# EAGLE design PCB Fuse Traces (EAGLE 6.3)
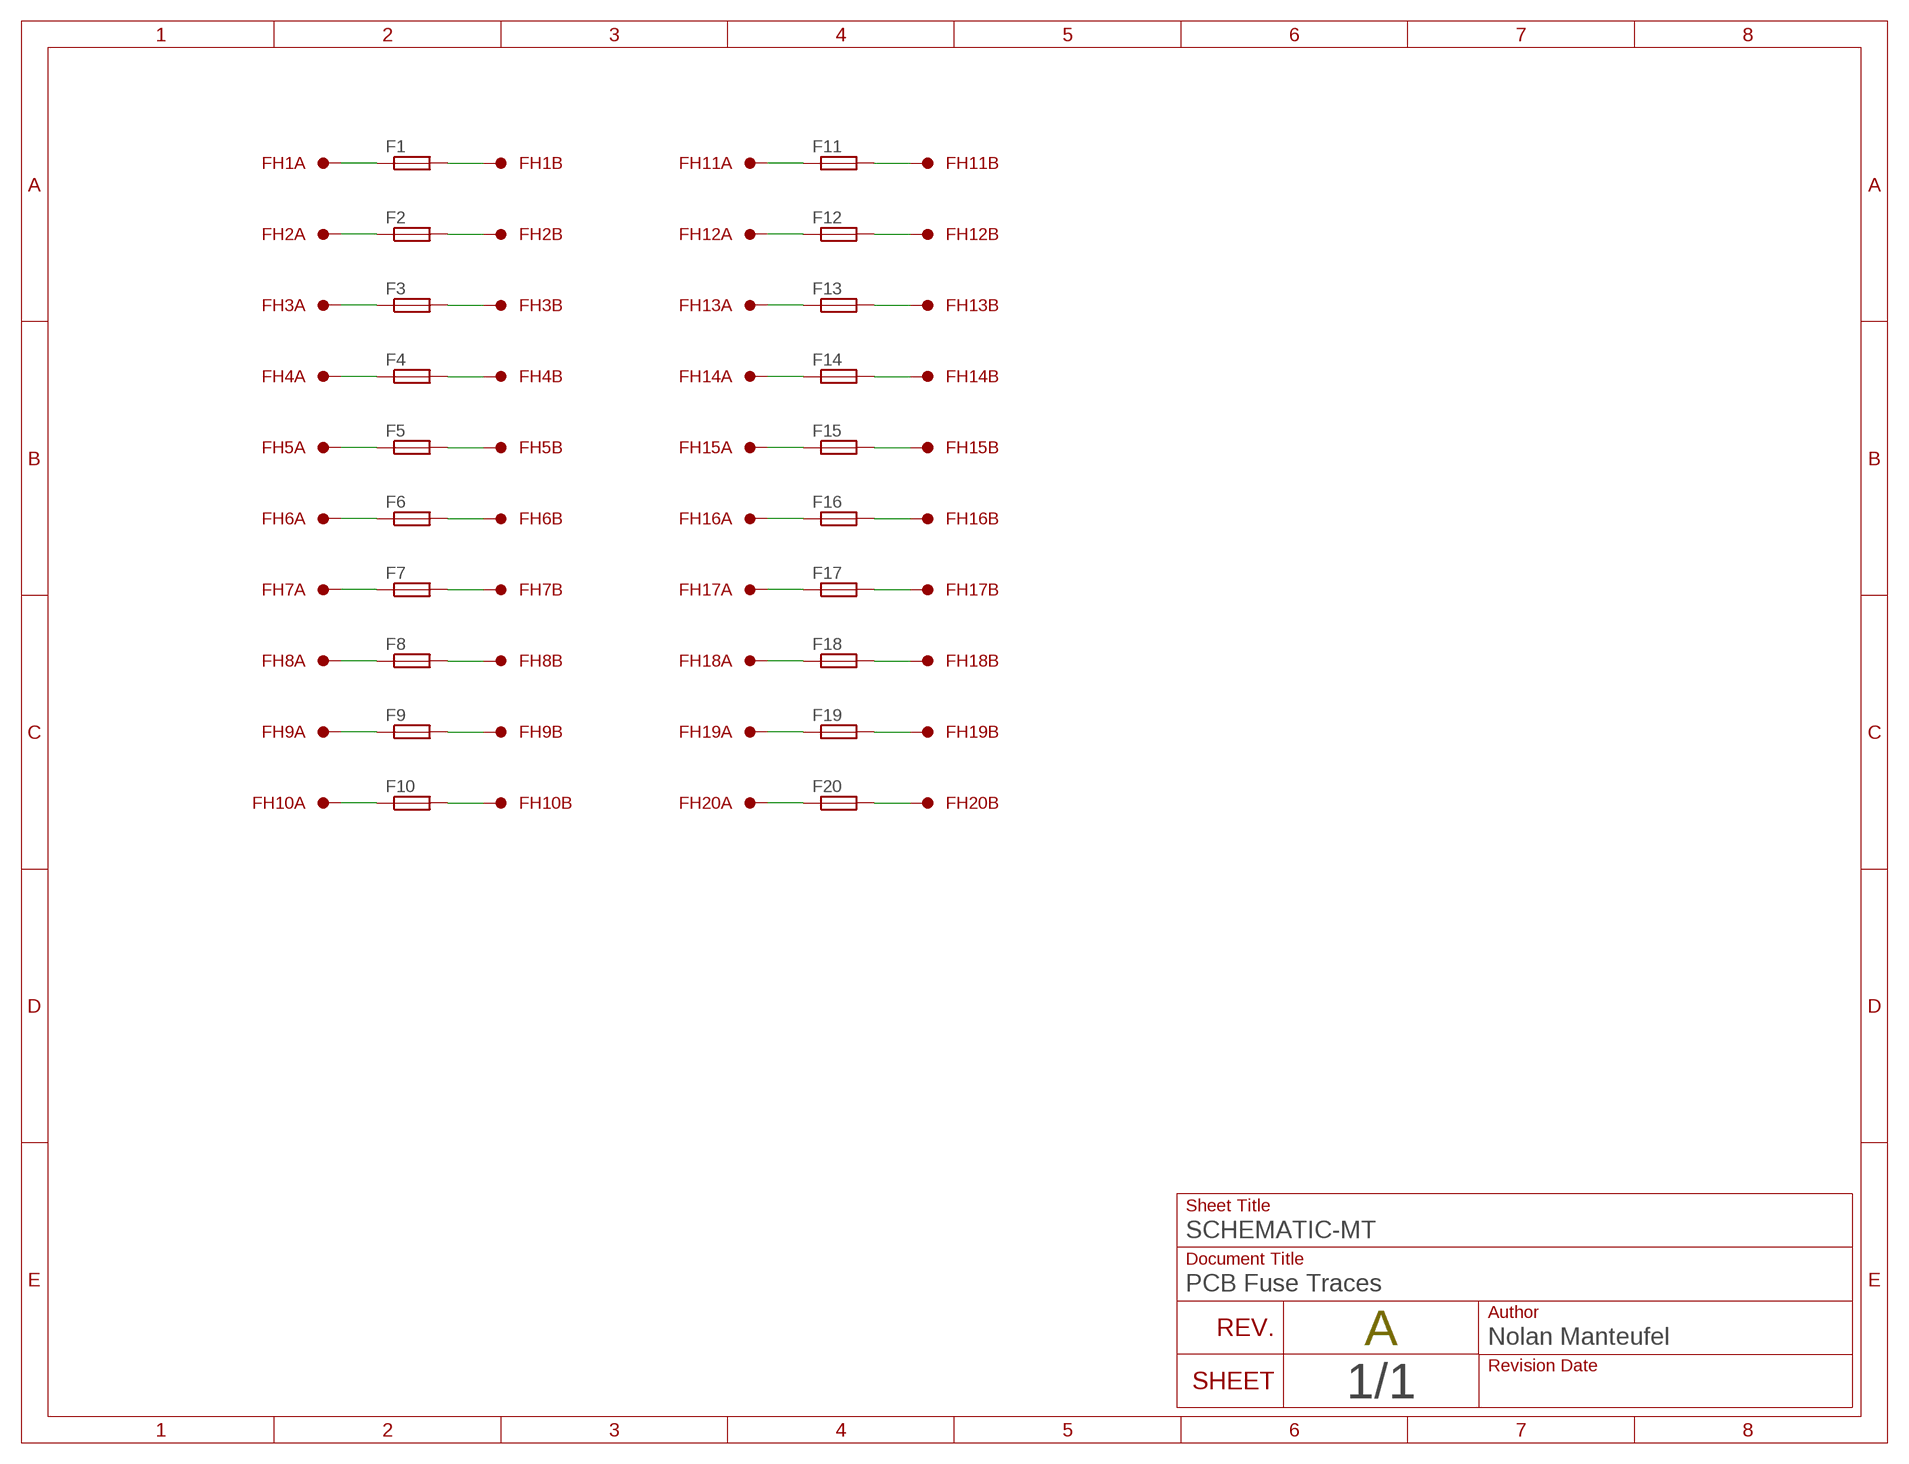
[diagram p0: schematic, sheet 1]

## Parts
F1  FUSEA  [FUSE_A]
F2  FUSEAA  [FUSE_AA]
F3  FUSEAAA  [FUSE_AAA]
F4  FUSEAAAA  [FUSE_AAAA]
F5  FUSEB  [FUSE_B]
F6  FUSEBB  [FUSE_BB]
F7  FUSEC  [FUSE_C]
F8  FUSECC  [FUSE_CC]
F9  FUSED  [FUSE_D]
F10  FUSEDD  [FUSE_DD]
F11  FUSEA0  [FUSE_A0]
F12  FUSEA1  [FUSE_A1]
F13  FUSEA3  [FUSE_A3]
F14  FUSEB1  [FUSE_B1]
F15  FUSEB2  [FUSE_B2]
F16  FUSEB3  [FUSE_B3]
F17  FUSEB4  [FUSE_B4]
F18  FUSE1206  [F1206]
F19  FUSE0805  [F0805]
F20  FUSE0603  [F0603]
FH1  FUSE_HOLDER36MM  [F36_HOLDER]
FH2  FUSE_HOLDER36MM  [F36_HOLDER]
FH3  FUSE_HOLDER36MM  [F36_HOLDER]
FH4  FUSE_HOLDER36MM  [F36_HOLDER]
FH5  FUSE_HOLDER36MM  [F36_HOLDER]
FH6  FUSE_HOLDER36MM  [F36_HOLDER]
FH7  FUSE_HOLDER36MM  [F36_HOLDER]
FH8  FUSE_HOLDER36MM  [F36_HOLDER]
FH9  FUSE_HOLDER36MM  [F36_HOLDER]
FH10  FUSE_HOLDER36MM  [F36_HOLDER]
FH11  FUSE_HOLDER36MM  [F36_HOLDER]
FH12  FUSE_HOLDER36MM  [F36_HOLDER]
FH13  FUSE_HOLDER36MM  [F36_HOLDER]
FH14  FUSE_HOLDER36MM  [F36_HOLDER]
FH15  FUSE_HOLDER36MM  [F36_HOLDER]
FH16  FUSE_HOLDER36MM  [F36_HOLDER]
FH17  FUSE_HOLDER36MM  [F36_HOLDER]
FH18  FUSE_HOLDER36MM  [F36_HOLDER]
FH19  FUSE_HOLDER36MM  [F36_HOLDER]
FH20  FUSE_HOLDER36MM  [F36_HOLDER]

## Nets
N$1: F1.1 FH1.1
N$2: F2.1 FH2.1
N$3: F3.1 FH3.1
N$4: F4.1 FH4.1
N$5: F1.2 FH1.2
N$6: F2.2 FH2.2
N$7: F3.2 FH3.2
N$8: F4.2 FH4.2
N$9: F5.1 FH5.1
N$10: F6.1 FH6.1
N$11: F7.1 FH7.1
N$12: F8.1 FH8.1
N$13: F5.2 FH5.2
N$14: F6.2 FH6.2
N$15: F7.2 FH7.2
N$16: F8.2 FH8.2
N$17: F9.1 FH9.1
N$18: F10.1 FH10.1
N$19: F11.3 FH11.1
N$20: F12.1 FH12.1
N$21: F9.2 FH9.2
N$22: F10.2 FH10.2
N$23: F11.4 FH11.2
N$24: F12.2 FH12.2
N$25: F13.1 FH13.1
N$26: F14.1 FH14.1
N$27: F15.1 FH15.1
N$28: F16.1 FH16.1
N$29: F13.2 FH13.2
N$30: F14.2 FH14.2
N$31: F15.2 FH15.2
N$32: F16.2 FH16.2
N$33: F17.1 FH17.1
N$34: F18.1 FH18.1
N$35: F19.1 FH19.1
N$36: F20.1 FH20.1
N$37: F17.2 FH17.2
N$38: F18.2 FH18.2
N$39: F19.2 FH19.2
N$40: F20.2 FH20.2

## Library data of the parts
F1-F20 = nolan:FUSE
FH1-FH20 = nolan:FUSE_HOLDER

## Board
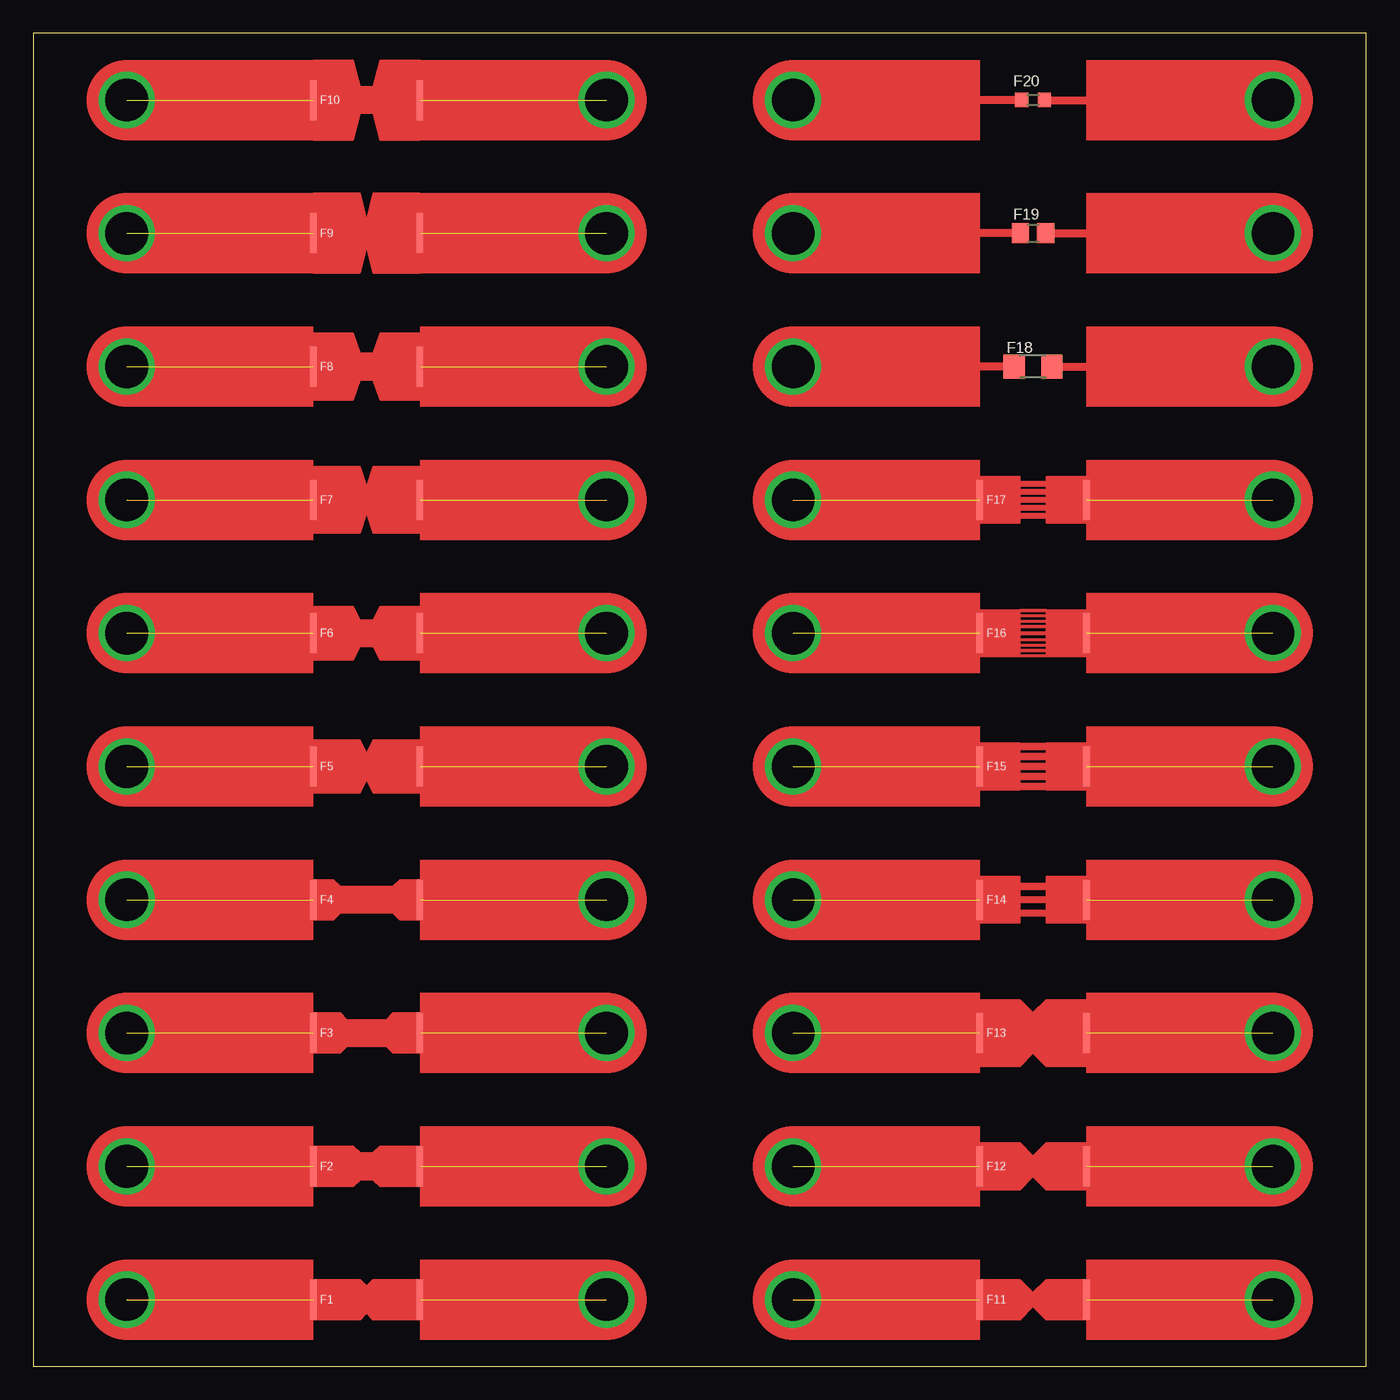
[diagram p1: board, top side]
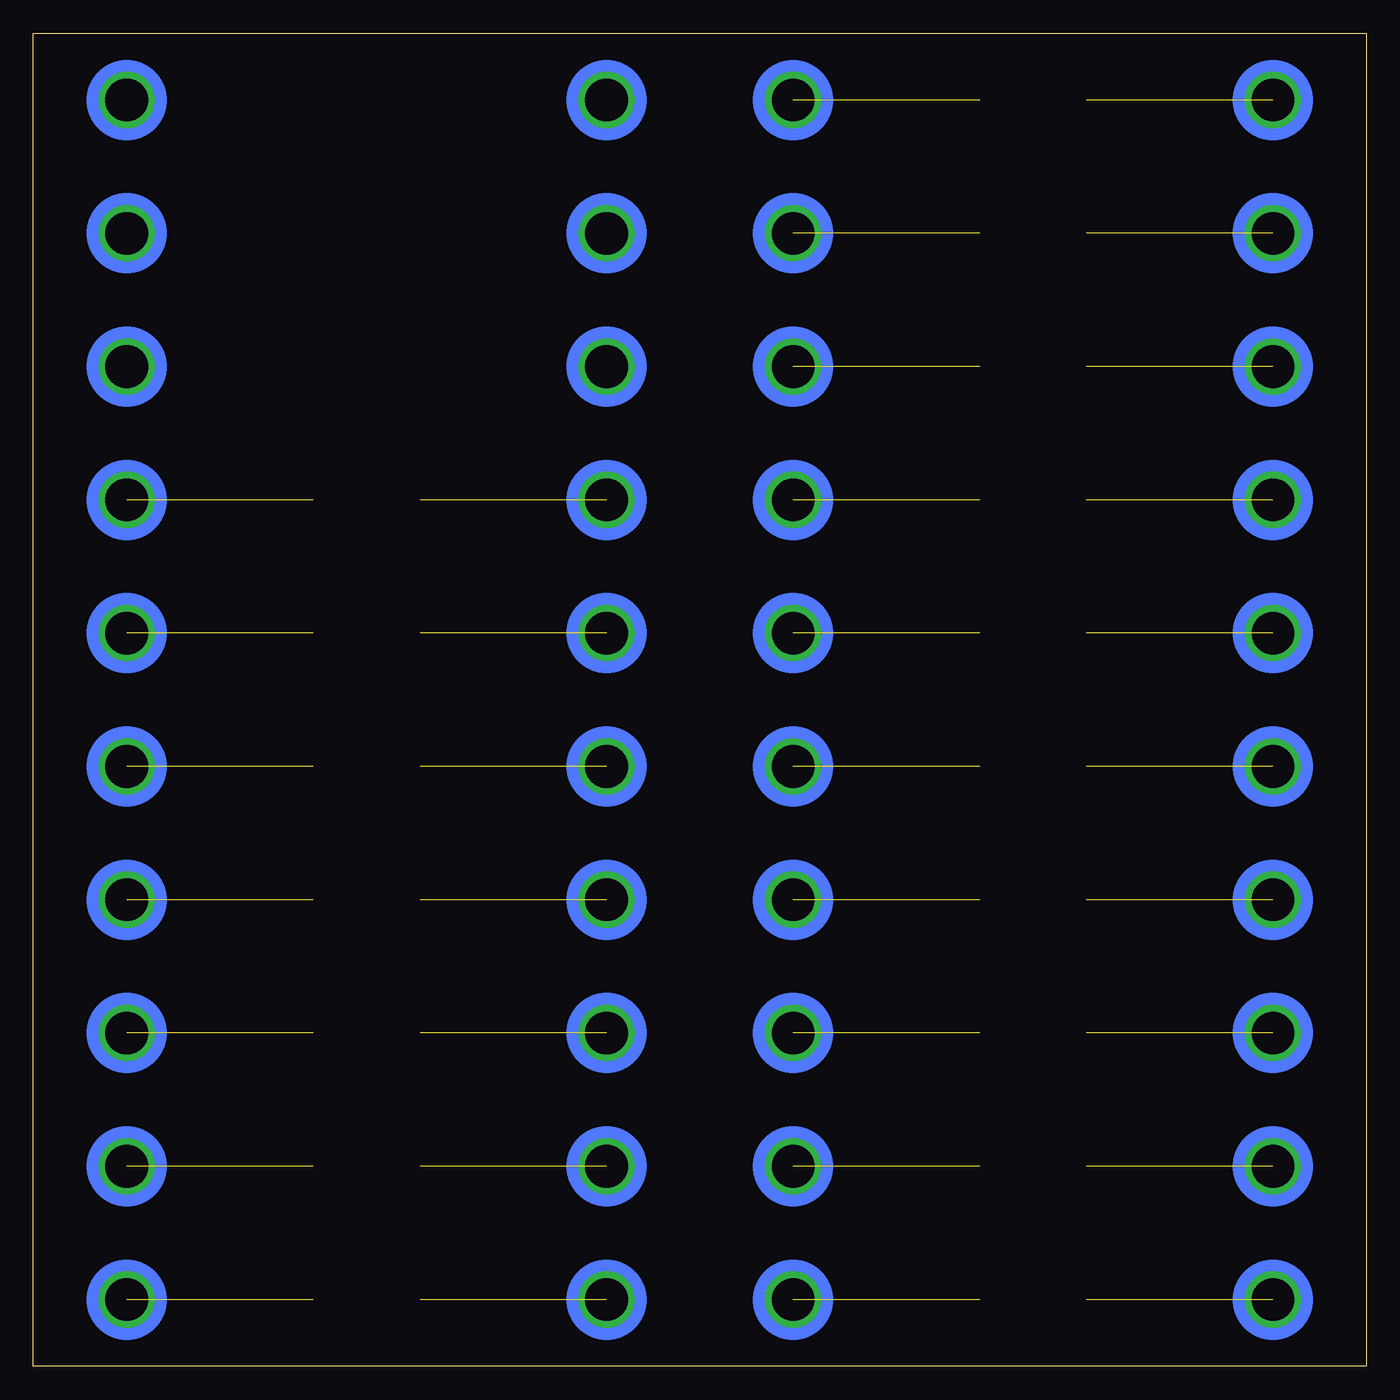
[diagram p2: board, bottom side, seen from below]

Size 100 x 100 mm. Coordinates in mm from the lower left corner, seen from the top.
Outline: 0,0 100,0 100,100 0,100 0,0
Copper layers (1*16): Top 0.035mm / dielectric 1.5mm / Bottom 0.035mm
Design rules "default": minimum track width 10mil, minimum drill 24mil, track to track 8mil, track to pad 8mil, pad to pad 8mil, via to via 8mil, smd to smd 8mil, copper to edge 40mil, drill to drill 8mil, minimum pad ring 10mil, minimum via ring 8mil, stop-mask expansion 4mil, vias tented up to drill 0mil, thermal gap 10mil

### Footprints (pad centres in the part's own frame; a part is rotated, then mirrored left to right if it is on the bottom)
FUSE_A = smd 0.5 x 3: 1 -4,0; 2 4,0
FUSE_AA = smd 0.5 x 3: 1 -4,0; 2 4,0
FUSE_AAA = smd 0.5 x 3: 1 -4,0; 2 4,0
FUSE_AAAA = smd 0.5 x 3: 1 -4,0; 2 4,0
FUSE_B = smd 0.5 x 3: 1 -4,0; 2 4,0
FUSE_BB = smd 0.5 x 3: 1 -4,0; 2 4,0
FUSE_C = smd 0.5 x 3: 1 -4,0; 2 4,0
FUSE_CC = smd 0.5 x 3: 1 -4,0; 2 4,0
FUSE_D = smd 0.5 x 3: 1 -4,0; 2 4,0
FUSE_DD = smd 0.5 x 3: 1 -4,0; 2 4,0
FUSE_A0 = smd 0.5 x 3: 3 -4,0; 4 4,0
FUSE_A1 = smd 0.5 x 3: 1 -4,0; 2 4,0
FUSE_A3 = smd 0.5 x 3: 1 -4,0; 2 4,0
FUSE_B1 = smd 0.5 x 3: 1 -4,0; 2 4,0
FUSE_B2 = smd 0.5 x 3: 1 -4,0; 2 4,0
FUSE_B3 = smd 0.5 x 3: 1 -4,0; 2 4,0
FUSE_B4 = smd 0.5 x 3: 1 -4,0; 2 4,0
F1206 = smd 1.6 x 1.803: 1 -1.422,0; 2 1.422,0
F0805 = smd 1.3 x 1.5: 1 -0.95,0; 2 0.95,0
F0603 = smd 1 x 1.1: 1 -0.85,0; 2 0.85,0
F36_HOLDER = drill 3.2: 1 -18,0; 2 18,0

### Placement (x,y rotation side)
F1  25,5 0 top
F2  25,15 0 top
F3  25,25 0 top
F4  25,35 0 top
F5  25,45 0 top
F6  25,55 0 top
F7  25,65 0 top
F8  25,75 0 top
F9  25,85 0 top
F10  25,95 0 top
F11  75,5 0 top
F12  75,15 0 top
F13  75,25 0 top
F14  75,35 0 top
F15  75,45 0 top
F16  75,55 0 top
F17  75,65 0 top
F18  75,75 0 top
F19  75,85 0 top
F20  75,95 0 top
FH1  25,5 0 top
FH2  25,15 0 top
FH3  25,25 0 top
FH4  25,35 0 top
FH5  25,45 0 top
FH6  25,55 0 top
FH7  25,65 0 top
FH8  25,75 0 top
FH9  25,85 0 top
FH10  25,95 0 top
FH11  75,5 0 top
FH12  75,15 0 top
FH13  75,25 0 top
FH14  75,35 0 top
FH15  75,45 0 top
FH16  75,55 0 top
FH17  75,65 0 top
FH18  75,75 0 top
FH19  75,85 0 top
FH20  75,95 0 top

### Tracks (layer width: path | path; a pad name or v marks a point on that pad's centre or on a via)
N$1  (1 unrouted)
N$2  (1 unrouted)
N$3  (1 unrouted)
N$4  (1 unrouted)
N$5  (1 unrouted)
N$6  (1 unrouted)
N$7  (1 unrouted)
N$8  (1 unrouted)
N$9  (1 unrouted)
N$10  (1 unrouted)
N$11  (1 unrouted)
N$12  (1 unrouted)
N$13  (1 unrouted)
N$14  (1 unrouted)
N$15  (1 unrouted)
N$16  (1 unrouted)
N$17  (1 unrouted)
N$18  (1 unrouted)
N$19  (1 unrouted)
N$20  (1 unrouted)
N$21  (1 unrouted)
N$22  (1 unrouted)
N$23  (1 unrouted)
N$24  (1 unrouted)
N$25  (1 unrouted)
N$26  (1 unrouted)
N$27  (1 unrouted)
N$28  (1 unrouted)
N$29  (1 unrouted)
N$30  (1 unrouted)
N$31  (1 unrouted)
N$32  (1 unrouted)
N$33  (1 unrouted)
N$34
  Top 0.61: F18.1 FH18.1
N$35
  Top 0.61: F19.1 FH19.1
N$36
  Top 0.61: F20.1 FH20.1
N$37  (1 unrouted)
N$38
  Top 0.61: F18.2 FH18.2
N$39
  Top 0.61: F19.2 FH19.2
N$40
  Top 0.61: F20.2 FH20.2
(copper drawn outside any net)
  shapes: Top area x40